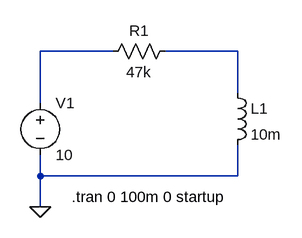
[diagram p0: schematic RL.asc]
RL.asc, the LTspice schematic file:
Version 4
SHEET 1 880 680
WIRE 144 -16 32 -16
WIRE 336 -16 224 -16
WIRE 336 48 336 -16
WIRE 32 64 32 -16
WIRE 32 176 32 144
WIRE 336 176 336 128
WIRE 336 176 32 176
WIRE 32 224 32 176
FLAG 32 224 0
SYMBOL voltage 32 48 R0
SYMATTR InstName V1
SYMATTR Value 10
SYMBOL res 240 -32 R90
WINDOW 0 0 56 VBottom 2
WINDOW 3 32 56 VTop 2
SYMATTR InstName R1
SYMATTR Value 47k
SYMBOL ind 320 32 R0
SYMATTR InstName L1
SYMATTR Value 10m
TEXT 80 208 Left 2 !.tran 0 100m 0 startup

The netlist it stands for:
* RL.asc
V1 N001 0 10
R1 N002 N001 47k
L1 N002 0 10m
.tran 0 100m 0 startup
.backanno
.end